# Altium schematic sheet ArduinoUnoShield.SchDoc
size A4
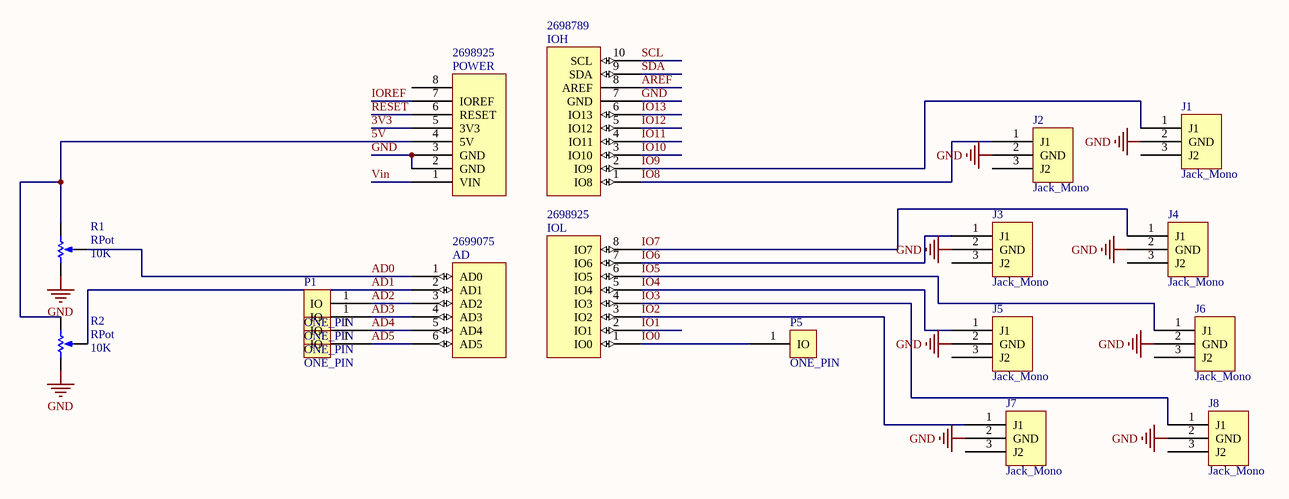
[diagram p0: ArduinoUnoShield.SchDoc]

## Parts
AD  Supplier Part Number 4: 2699075  [Header 6x1 8.5mm]  (hidden comment: AD)
IOH  Supplier Part Number 3: 2698789  [Header 10x1 8.5mm]  (hidden comment: IOH)
IOL  Supplier Part Number 4: 2698925  [Header 8x1 8.5mm]  (hidden comment: IOL)
J1  Jack_Mono  [JACK_MONO]
J2  Jack_Mono  [JACK_MONO]
J3  Jack_Mono  [JACK_MONO]
J4  Jack_Mono  [JACK_MONO]
J5  Jack_Mono  [JACK_MONO]
J6  Jack_Mono  [JACK_MONO]
J7  Jack_Mono  [JACK_MONO]
J8  Jack_Mono  [JACK_MONO]
P1  ONE_PIN  [ONE_PIN]
P2  ONE_PIN  [ONE_PIN]
P3  ONE_PIN  [ONE_PIN]
P4  ONE_PIN  [ONE_PIN]
P5  ONE_PIN  [ONE_PIN]
POWER  Supplier Part Number 4: 2698925  [Header 8x1 8.5mm]  (hidden comment: POWER_UNO)
R1  RPot  value 10K  [VR5]
R2  RPot  value 10K  [VR5]

## Nets
GND: IOH.7(GND) J1.2(GND) J2.2(GND) J3.2(GND) J4.2(GND) J5.2(GND) J6.2(GND) J7.2(GND) J8.2(GND) POWER.2(GND) POWER.3(GND) R1.1(TOP) R2.1(TOP)
3V3: POWER.5(3V3)
5V: POWER.4(5V) R1.2(BOT) R2.2(BOT)
AD0: AD.1(AD0) R1.3(TAP)
AD1: AD.2(AD1) R2.3(TAP)
AD2: AD.3(AD2) P1.1(IO)
AD3: AD.4(AD3) P2.1(IO)
AD4: AD.5(AD4) P3.1(IO)
AD5: AD.6(AD5) P4.1(IO)
AREF: IOH.8(AREF)
IO0: IOL.1(IO0) P5.1(IO)
IO1: IOL.2(IO1)
IO2: IOL.3(IO2) J7.1(J1)
IO3: IOL.4(IO3) J8.1(J1)
IO4: IOL.5(IO4) J5.1(J1)
IO5: IOL.6(IO5) J6.1(J1)
IO6: IOL.7(IO6) J3.1(J1)
IO7: IOL.8(IO7) J4.1(J1)
IO8: IOH.1(IO8) J2.1(J1)
IO9: IOH.2(IO9) J1.1(J1)
IO10: IOH.3(IO10)
IO11: IOH.4(IO11)
IO12: IOH.5(IO12)
IO13: IOH.6(IO13)
IOREF: POWER.7(IOREF)
RESET: POWER.6(RESET)
SCL: IOH.10(SCL)
SDA: IOH.9(SDA)
Vin: POWER.1(VIN)

Not connected (* = marked no-connect by the designer): J1 3(J2); J2 3(J2); J3 3(J2); J4 3(J2); J5 3(J2); J6 3(J2); J7 3(J2); J8 3(J2); POWER 8

## Library data of the parts
R1 R2 = RPot: Potentiometer; Sim Note: Enter the Resistance value and the set point into parameter fields.; Set Position: 0.5; Published: 8-Jun-2000; LatestRevisionDate: 17-Jul-2002; LatestRevisionNote: Re-released for DXP Platform.; PackageReference: VR5; Publisher: Altium Limited; PackageDescription: Variable Resistor, Thru-Hole; 3 Leads
AD = AD: Supplier 1: Arrow; Supplier Part Number 1: 2699089; Supplier 2: Digi-Key; Supplier Part Number 2: SAM1198-06-ND; Supplier 3: Arrow; Supplier Part Number 3: 2699088; Supplier 4: Arrow
IOH = IOH: Supplier 1: Arrow; Supplier Part Number 1: 2698803S4475693N1004; Supplier 2: Digi-Key; Supplier Part Number 2: SAM1198-10-ND; Supplier 3: Arrow
IOL = IOL: Supplier 1: Digi-Key; Supplier Part Number 1: SAM1198-08-ND; Supplier 2: Arrow; Supplier Part Number 2: 2698939; Supplier 3: Arrow; Supplier Part Number 3: 2698940; Supplier 4: Arrow
POWER = POWER_UNO: Supplier 1: Digi-Key; Supplier Part Number 1: SAM1198-08-ND; Supplier 2: Arrow; Supplier Part Number 2: 2698939; Supplier 3: Arrow; Supplier Part Number 3: 2698940; Supplier 4: Arrow